# Altium schematic sheet Audio.SchDoc
size A4; SheetNumber: 4; SheetTotal: 4
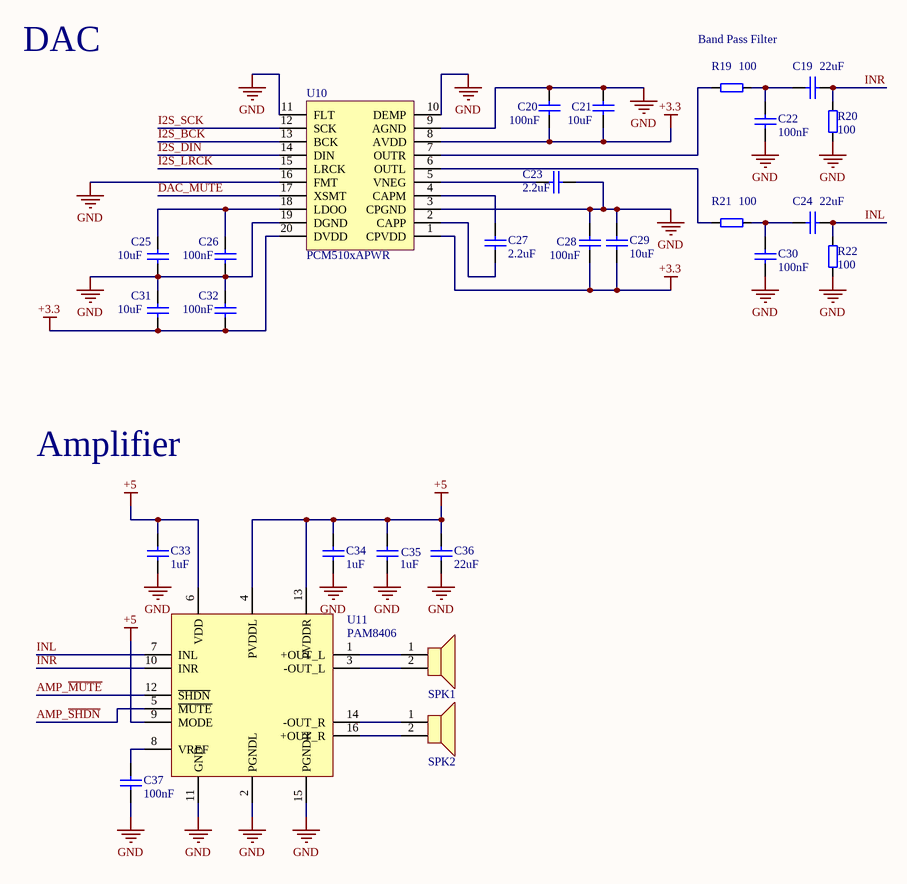
[diagram p0: Audio.SchDoc]

## Parts
C19  Capacitance: 22uF  [CAP 0805]  (hidden comment: Capacitor_22uF)
C20  Capacitance: 100nF  [CAP 0805]  (hidden comment: Capacitor_100nF)
C21  Capacitance: 10uF  [CAP 0805]  (hidden comment: Capacitor_10uF)
C22  Capacitance: 100nF  [CAP 0805]  (hidden comment: Capacitor_100nF)
C23  Capacitance: 2.2uF  [CAP 0805]  (hidden comment: Capacitor_2.2uF)
C24  Capacitance: 22uF  [CAP 0805]  (hidden comment: Capacitor_22uF)
C25  Capacitance: 10uF  [CAP 0805]  (hidden comment: Capacitor_10uF)
C26  Capacitance: 100nF  [CAP 0805]  (hidden comment: Capacitor_100nF)
C27  Capacitance: 2.2uF  [CAP 0805]  (hidden comment: Capacitor_2.2uF)
C28  Capacitance: 100nF  [CAP 0805]  (hidden comment: Capacitor_100nF)
C29  Capacitance: 10uF  [CAP 0805]  (hidden comment: Capacitor_10uF)
C30  Capacitance: 100nF  [CAP 0805]  (hidden comment: Capacitor_100nF)
C31  Capacitance: 10uF  [CAP 0805]  (hidden comment: Capacitor_10uF)
C32  Capacitance: 100nF  [CAP 0805]  (hidden comment: Capacitor_100nF)
C33  Capacitance: 1uF  [CAP 0805]  (hidden comment: Capacitor_1uF)
C34  Capacitance: 1uF  [CAP 0805]  (hidden comment: Capacitor_1uF)
C35  Capacitance: 1uF  [CAP 0805]  (hidden comment: Capacitor_1uF)
C36  Capacitance: 22uF  [CAP 0805]  (hidden comment: Capacitor_22uF)
C37  Capacitance: 100nF  [CAP 0805]  (hidden comment: Capacitor_100nF)
R19  Resistance: 100  [RES 0805]  (hidden comment: Resistor_100)
R20  Resistance: 100  [RES 0805]  (hidden comment: Resistor_100)
R21  Resistance: 100  [RES 0805]  (hidden comment: Resistor_100)
R22  Resistance: 100  [RES 0805]  (hidden comment: Resistor_100)
SPK1  Speaker  [2Pin]  (value not drawn)
SPK2  Speaker  [2Pin]  (value not drawn)
U10  PCM510xAPWR  [TSOP-20]
U11  PAM8406  [SOP-16N]

## Nets
+3.3: C20.1 C21.1 C28.1 C29.1 C31.1 C32.1 U10.1(CPVDD) U10.8(AVDD) U10.20(DVDD)
+5: C33.2 C34.2 C35.2 C36.2 U11.4(PVDDL) U11.6(VDD) U11.9(MODE) U11.13(PVDDR)
GND: C20.2 C21.2 C22.1 C23.1 C25.1 C26.1 C28.2 C29.2 C30.1 C31.2 C32.2 C33.1 C34.1 C35.1 C36.1 C37.1 R20.1 R22.1 U10.3(CPGND) U10.9(AGND) U10.10(DEMP) U10.11(FLT) U10.16(FMT) U10.19(DGND) U11.2(PGNDL) U11.11(GND) U11.15(PGNDR)
AMP_~{MUTE}: U11.12(~{SHDN})
AMP_~{SHDN}: U11.5(~{MUTE})
DAC_MUTE: U10.17(XSMT)
I2S_BCK: U10.13(BCK)
I2S_DIN: U10.14(DIN)
I2S_LRCK: U10.15(LRCK)
I2S_SCK: U10.12(SCK)
INL: C24.2 R22.2 U11.7(INL)
INR: C19.2 R20.2 U11.10(INR)
NetC19_1: C19.1 C22.2 R19.2
NetC23_2: C23.2 U10.5(VNEG)
NetC24_1: C24.1 C30.2 R21.2
NetC25_2: C25.2 C26.2 U10.18(LDOO)
NetC27_1: C27.1 U10.4(CAPM)
NetC27_2: C27.2 U10.2(CAPP)
NetC37_2: C37.2 U11.8(VREF)
NetR19_1: R19.1 U10.7(OUTR)
NetR21_1: R21.1 U10.6(OUTL)
NetSPK1_1: SPK1.1 U11.1(+OUT_L)
NetSPK1_2: SPK1.2 U11.3(-OUT_L)
NetSPK2_1: SPK2.1 U11.14(-OUT_R)
NetSPK2_2: SPK2.2 U11.16(+OUT_R)

## Notes on the sheet
- DAC
- Band Pass Filter
- Amplifier